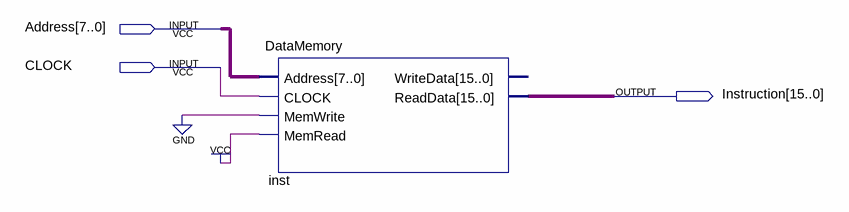
[diagram p0: schematic sheet]
// Quartus schematic InstructionMemory.bdf as structural Verilog: 1 symbols, 3 pins
module InstructionMemory (
  input  [7:0] Address,
  input  CLOCK,
  output [15:0] Instruction
);

  DataMemory inst (
    .Address(Address), .CLOCK(CLOCK), .MemWrite(1'b0), .MemRead(1'b1), .ReadData(Instruction));  // open: WriteData
endmodule
